# Altium schematic sheet Relay_RC.SchDoc
size A3
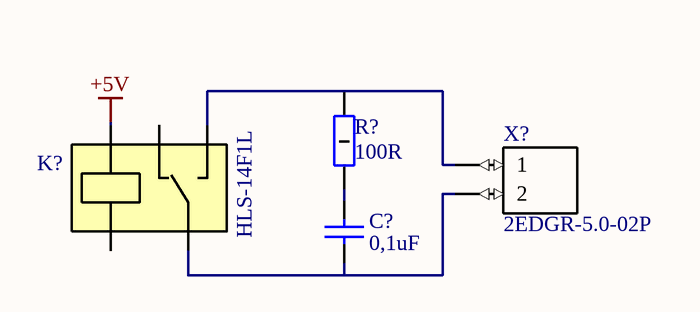
[diagram p0: Relay_RC.SchDoc]

## Parts
C?  value 0,1uF  [MPX_P10]  (hidden comment: Cap_Semi)
K?  HLS-14F1L  [HLS-14F1L]
R?  value 100R  [С5-16МВ_1W-5]  (hidden comment: Resistor 1W С5-16МВ)
X?  2EDGR-5.0-02P  [2EDGR-5.0-02P]

## Nets
+5V: K?.1
NetC?_1: C?.1 R?.1
NetC?_2: C?.2 K?.4 X?.2
NetK?_5: K?.5 R?.2 X?.1

Not connected (* = marked no-connect by the designer): K? 2 3

## Library data of the parts
C? = Cap_Semi: Capacitor Semi
K? = HLS-14F1L: 10A 240Vac 1 pole Slim relay
R? = Resistor 1W